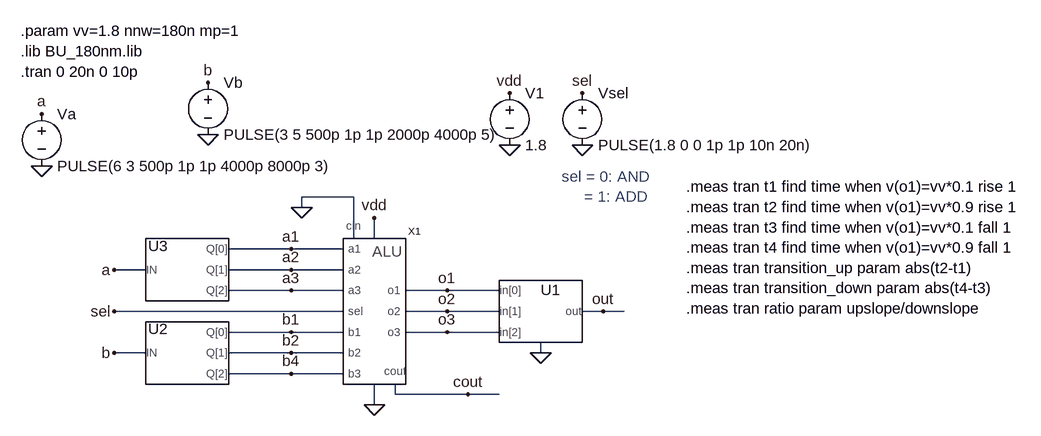
[diagram p0: schematic alu_test_trans.asc]
alu_test_trans.asc, the LTspice schematic file:
Version 4
SHEET 1 1464 680
WIRE 368 64 288 64
WIRE 288 80 288 64
WIRE 368 128 368 64
WIRE 400 128 400 96
WIRE 272 144 176 144
WIRE 352 144 272 144
WIRE 48 176 0 176
WIRE 272 176 176 176
WIRE 352 176 272 176
WIRE 272 208 176 208
WIRE 352 208 272 208
WIRE 512 208 448 208
WIRE 592 208 512 208
WIRE 352 240 0 240
WIRE 512 240 448 240
WIRE 592 240 512 240
WIRE 752 240 720 240
WIRE 784 240 752 240
WIRE 272 272 176 272
WIRE 352 272 272 272
WIRE 512 272 448 272
WIRE 592 272 512 272
WIRE 48 304 0 304
WIRE 272 304 176 304
WIRE 352 304 272 304
WIRE 656 304 656 288
WIRE 272 336 176 336
WIRE 352 336 272 336
WIRE 432 368 432 352
WIRE 544 368 432 368
WIRE 592 368 544 368
WIRE 400 384 400 352
FLAG 752 240 out
FLAG 400 96 vdd
FLAG 400 384 0
FLAG 608 -16 0
FLAG -112 16 0
FLAG 144 -32 0
FLAG 608 -96 vdd
FLAG -112 -64 a
FLAG 144 -112 b
FLAG 0 176 a
FLAG 0 304 b
FLAG 720 -16 0
FLAG 720 -96 sel
FLAG 0 240 sel
FLAG 288 80 0
FLAG 544 368 cout
FLAG 512 208 o1
FLAG 512 240 o2
FLAG 512 272 o3
FLAG 272 144 a1
FLAG 272 176 a2
FLAG 272 208 a3
FLAG 272 272 b1
FLAG 272 304 b2
FLAG 272 336 b4
FLAG 656 304 0
SYMBOL alu 400 240 R0
SYMATTR InstName X1
SYMBOL Bin2Dec 656 240 R0
SYMATTR InstName U1
SYMATTR SpiceLine Vhigh={vv}
SYMBOL Dec2Bin 112 304 R0
SYMATTR InstName U2
SYMATTR SpiceLine Vhigh={vv}
SYMBOL Dec2Bin 112 176 R0
SYMATTR InstName U3
SYMATTR SpiceLine Vhigh={vv}
SYMBOL /voltage 608 -112 R0
SYMATTR InstName V1
SYMATTR Value 1.8
SYMBOL /voltage -112 -80 R0
SYMATTR InstName Va
SYMATTR Value PULSE(6 3 500p 1p 1p 4000p 8000p 3)
SYMBOL /voltage 144 -128 R0
SYMATTR InstName Vb
SYMATTR Value PULSE(3 5 500p 1p 1p 2000p 4000p 5)
SYMBOL /voltage 720 -112 R0
WINDOW 123 0 0 Left 0
WINDOW 39 0 0 Left 0
SYMATTR InstName Vsel
SYMATTR Value PULSE(1.8 0 0 1p 1p 10n 20n)
TEXT -144 -192 Left 2 !.param vv=1.8 nnw=180n mp=1\n.lib BU_180nm.lib\n.tran 0 20n 0 10p
TEXT 688 32 Left 2 ;sel = 0: AND\n     = 1: ADD
TEXT 880 48 Left 2 !.meas tran t1 find time when v(o1)=vv*0.1 rise 1\n.meas tran t2 find time when v(o1)=vv*0.9 rise 1\n.meas tran t3 find time when v(o1)=vv*0.1 fall 1\n.meas tran t4 find time when v(o1)=vv*0.9 fall 1\n.meas tran transition_up param abs(t2-t1)\n.meas tran transition_down param abs(t4-t3)\n.meas tran ratio param upslope/downslope

The netlist it stands for:
* alu_test_trans.asc
XX1 vdd a1 a2 a3 b1 b2 b4 0 o1 o2 o3 sel cout 0 alu  ; pins vdd a1 a2 a3 b1 b2 b3 vss o1 o2 o3 sel cout cin
XU1 o1 o2 o3 out Bin2Dec Vhigh={vv}  ; pins in[0] in[1] in[2] out
XU2 b b1 b2 b4 Dec2Bin Vhigh={vv}  ; pins IN Q[0] Q[1] Q[2]
XU3 a a1 a2 a3 Dec2Bin Vhigh={vv}  ; pins IN Q[0] Q[1] Q[2]
V1 vdd 0 1.8
Va a 0 PULSE(6 3 500p 1p 1p 4000p 8000p 3)
Vb b 0 PULSE(3 5 500p 1p 1p 2000p 4000p 5)
Vsel sel 0 PULSE(1.8 0 0 1p 1p 10n 20n)
.param vv=1.8 nnw=180n mp=1
.lib BU_180nm.lib
.tran 0 20n 0 10p
* sel = 0: AND
*      = 1: ADD
.meas tran t1 find time when v(o1)=vv*0.1 rise 1
.meas tran t2 find time when v(o1)=vv*0.9 rise 1
.meas tran t3 find time when v(o1)=vv*0.1 fall 1
.meas tran t4 find time when v(o1)=vv*0.9 fall 1
.meas tran transition_up param abs(t2-t1)
.meas tran transition_down param abs(t4-t3)
.meas tran ratio param upslope/downslope
.lib alu.asc
.lib Bin2Dec.sub
.lib Dec2Bin.sub
.backanno
.end

* Results of the author's LTspice run, read from the files saved beside the schematic
* Operating Point, zero values left out:
*   V(vdd) = 1.8 V
*   V(b1) = 1.8 V
*   V(a2) = 1.8 V
*   V(b2) = 1.8 V
*   V(a3) = 1.8 V
*   V(sel) = 1.8 V
*   V(o1) = 1.8 V
*   V(o2) = 1.23 µV
*   V(o3) = 1.23 µV
*   V(cout) = 1.8 V
*   V(out) = 1 V
*   V(b) = 3 V
*   V(a) = 6 V
*   I(Vb) = -300 A
*   I(Va) = -600 A
*   I(V1) = -3.355 µA
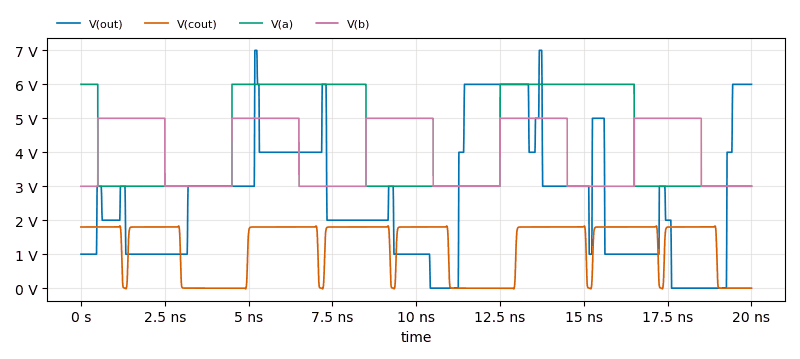
[diagram p1: Transient Analysis of alu_test_trans.asc, plotted from the saved traces]
* Transient Analysis, 1 run:
*   V(out): min 0 V, max 7 V, average 2.589 V, rms 3.219 V, last 6 V
*   V(cout): min -19.45 mV, max 1.832 V, average 1.262 V, rms 1.498 V, last 1.23 µV
*   V(a): min 3 V, max 6 V, average 4.275 V, rms 4.525 V, last 3 V
*   V(b): min 3 V, max 5 V, average 4 V, rms 4.124 V, last 3 V
* From the log:
*   t1: time=1.14297e-009 at 1.14297e-009
*   t2: time=1.198e-009 at 1.198e-009
*   t3: time=6.45855e-010 at 6.45855e-010
*   t4: time=5.96796e-010 at 5.96796e-010
*   transition_up: abs(t2-t1)=5.50271e-011
*   transition_down: abs(t4-t3)=4.90591e-011
*   Measurement "ratio" FAIL'ed